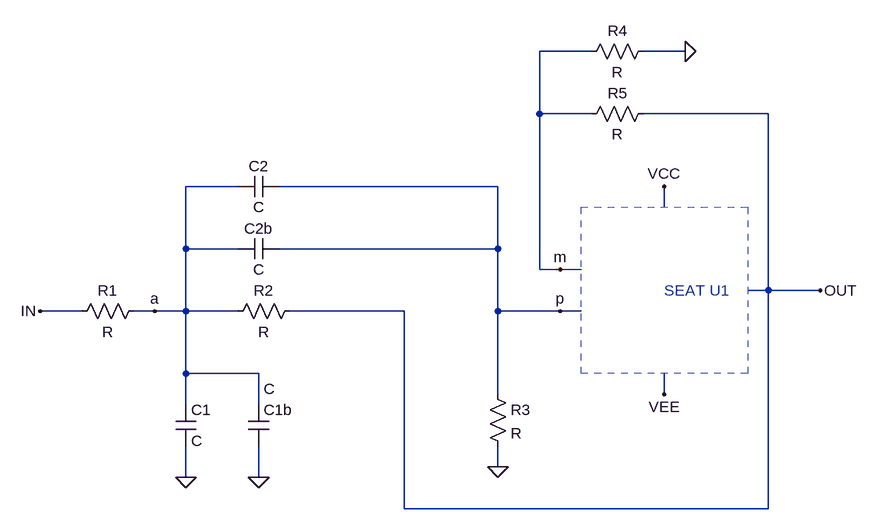
[diagram p0: schematic SK_BP.asc]
SK_BP.asc, the LTspice schematic file:
Version 4.1
SHEET 1 2076 680
WIRE 144 -112 64 -112
WIRE 288 -112 224 -112
WIRE 64 -16 64 -112
WIRE 144 -16 64 -16
WIRE 416 -16 224 -16
WIRE -400 96 -480 96
WIRE 0 96 -336 96
WIRE 256 128 256 96
WIRE -480 192 -480 96
WIRE -400 192 -480 192
WIRE 0 192 0 96
WIRE 0 192 -336 192
WIRE 64 224 64 -16
WIRE 96 224 64 224
WIRE 128 224 96 224
WIRE 416 256 416 -16
WIRE 416 256 384 256
WIRE 496 256 416 256
WIRE -640 288 -704 288
WIRE -528 288 -560 288
WIRE -480 288 -480 192
WIRE -480 288 -528 288
WIRE -400 288 -480 288
WIRE -144 288 -320 288
WIRE 0 288 0 192
WIRE 96 288 0 288
WIRE 128 288 96 288
WIRE -480 384 -480 288
WIRE -368 384 -480 384
WIRE 0 416 0 288
WIRE 256 416 256 384
WIRE -480 432 -480 384
WIRE -368 432 -368 384
WIRE 0 528 0 496
WIRE -480 544 -480 496
WIRE -368 544 -368 496
WIRE -144 592 -144 288
WIRE 416 592 416 256
WIRE 416 592 -144 592
FLAG 496 256 OUT
FLAG 256 96 VCC
FLAG 256 416 VEE
FLAG 96 224 m
FLAG 96 288 p
FLAG -528 288 a
FLAG -704 288 IN
FLAG 288 -112 0
FLAG -480 544 0
FLAG -368 544 0
FLAG 0 528 0
SYMBOL res -544 272 R90
WINDOW 0 0 56 VBottom 2
WINDOW 3 32 56 VTop 2
SYMATTR InstName R1
SYMBOL res -304 272 R90
WINDOW 0 0 56 VBottom 2
WINDOW 3 32 56 VTop 2
SYMATTR InstName R2
SYMBOL res -16 400 R0
SYMATTR InstName R3
SYMBOL res 240 -32 R90
WINDOW 0 0 56 VBottom 2
WINDOW 3 32 56 VTop 2
SYMATTR InstName R5
SYMBOL res 240 -128 R90
WINDOW 0 0 56 VBottom 2
WINDOW 3 32 56 VTop 2
SYMATTR InstName R4
SYMBOL cap -496 432 R0
SYMATTR InstName C1
SYMBOL cap -336 80 R90
WINDOW 0 0 32 VBottom 2
WINDOW 3 32 32 VTop 2
SYMATTR InstName C2
SYMBOL cap -384 432 R0
WINDOW 3 24 -24 Left 2
SYMATTR InstName C1b
SYMBOL cap -336 176 R90
WINDOW 0 0 32 VBottom 2
WINDOW 3 32 32 VTop 2
SYMATTR InstName C2b
TEXT 256 256 Left 2 ;SEAT U1
RECTANGLE Normal 128 128 384 384 2

The netlist it stands for:
* SK_BP.asc
R1 a IN R
R2 OUT a R
R3 p 0 R
R5 OUT m R
R4 0 m R
C1 a 0 C
C2 p a C
C1b a 0 C
C2b p a C
* SEAT U1
.backanno
.end